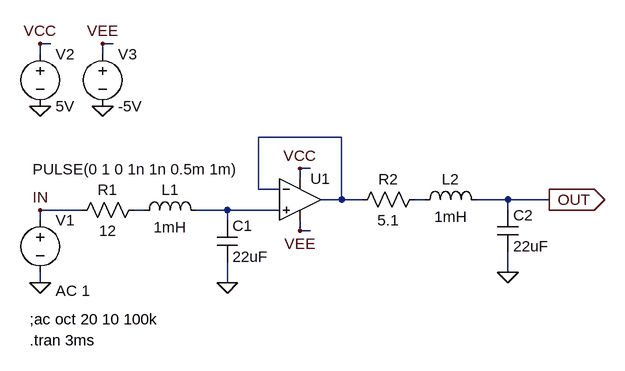
[diagram p0: schematic 4thButterWorthLPF_1mH.asc]
4thButterWorthLPF_1mH.asc, the LTspice schematic file:
Version 4
SHEET 1 964 680
WIRE -32 -128 -48 -128
WIRE 64 -128 48 -128
WIRE -48 -112 -48 -128
WIRE 48 -112 48 -128
WIRE 416 16 288 16
WIRE 368 64 352 64
WIRE 352 80 352 64
WIRE 288 96 288 16
WIRE 320 96 288 96
WIRE 416 112 416 16
WIRE 416 112 384 112
WIRE 448 112 416 112
WIRE 544 112 528 112
WIRE 672 112 624 112
WIRE 736 112 672 112
WIRE 16 128 -48 128
WIRE 112 128 96 128
WIRE 240 128 192 128
WIRE 320 128 240 128
WIRE 672 128 672 112
WIRE -48 144 -48 128
WIRE 240 144 240 128
WIRE 352 160 352 144
WIRE 368 160 352 160
WIRE 672 224 672 192
WIRE -48 240 -48 224
WIRE 240 240 240 208
FLAG 240 240 0
FLAG -48 240 0
FLAG 736 112 OUT
IOPIN 736 112 Out
FLAG 672 224 0
FLAG 352 64 VCC
FLAG 352 160 VEE
FLAG -48 -32 0
FLAG 48 -32 0
FLAG -48 -128 VCC
FLAG 48 -128 VEE
FLAG -48 128 IN
SYMBOL ind 96 144 R270
WINDOW 0 32 56 VTop 2
WINDOW 3 5 56 VBottom 2
SYMATTR InstName L1
SYMATTR Value 1mH
SYMBOL res 112 112 R90
WINDOW 0 0 56 VBottom 2
WINDOW 3 32 56 VTop 2
SYMATTR InstName R1
SYMATTR Value 12
SYMBOL cap 224 144 R0
SYMATTR InstName C1
SYMATTR Value 22uF
SYMBOL voltage -48 128 R0
WINDOW 123 24 124 Left 2
WINDOW 39 0 0 Left 2
WINDOW 3 -12 -63 Left 2
SYMATTR Value2 AC 1
SYMATTR InstName V1
SYMATTR Value PULSE(0 1 0 1n 1n 0.5m 1m)
SYMBOL ind 528 128 R270
WINDOW 0 32 56 VTop 2
WINDOW 3 5 56 VBottom 2
SYMATTR InstName L2
SYMATTR Value 1mH
SYMBOL res 544 96 R90
WINDOW 0 0 56 VBottom 2
WINDOW 3 32 56 VTop 2
SYMATTR InstName R2
SYMATTR Value 5.1
SYMBOL cap 656 128 R0
SYMATTR InstName C2
SYMATTR Value 22uF
SYMBOL Opamps\\UniversalOpamp2 352 112 R0
SYMATTR InstName U1
SYMBOL voltage -48 -128 R0
WINDOW 123 0 0 Left 2
WINDOW 39 0 0 Left 2
SYMATTR InstName V2
SYMATTR Value 5V
SYMBOL voltage 48 -128 R0
SYMATTR InstName V3
SYMATTR Value -5V
TEXT -64 296 Left 2 !;ac oct 20 10 100k
TEXT -64 328 Left 2 !.tran 3ms

The netlist it stands for:
* 4thButterWorthLPF_1mH.asc
L1 N003 N004 1mH
R1 N003 IN 12
C1 N004 0 22uF
V1 IN 0 PULSE(0 1 0 1n 1n 0.5m 1m) AC 1
L2 N002 OUT 1mH
R2 N002 N001 5.1
C2 OUT 0 22uF
XU1 N004 N001 VCC VEE N001 level.2 Avol=1Meg GBW=10Meg Slew=10Meg ilimit=25m rail=0 Vos=0 phimargin=45 en=0 enk=0 in=0 ink=0 Rin=500Meg  ; pins IN+ IN- V+ V- OUT
V2 VCC 0 5V
V3 VEE 0 -5V
;ac oct 20 10 100k
.tran 3ms
.lib UniversalOpamps2.sub
.backanno
.end